# Altium schematic sheet transmitter_SCH.SchDoc
size A; SheetNumber: 1; SheetTotal: 1
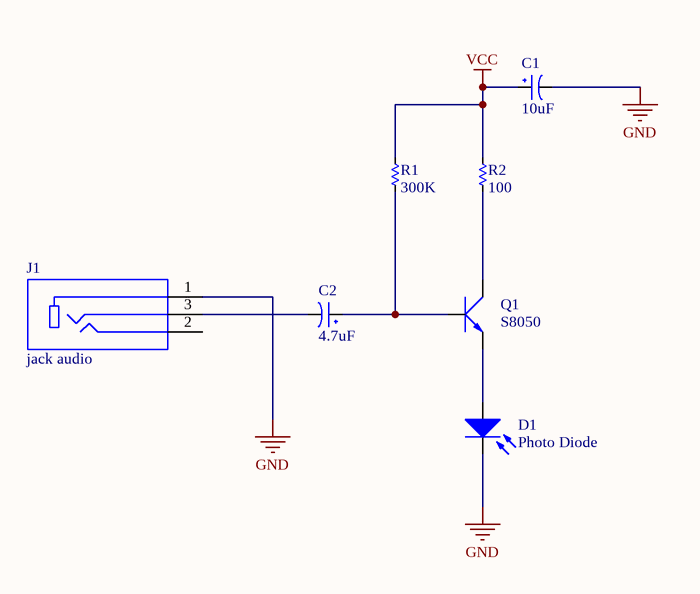
[diagram p0: transmitter_SCH.SchDoc]

## Parts
C1  10uF  [tu hoa 4mm]
C2  4.7uF  [tu hoa 5mm]
D1  Photo Diode  [LED-5 GRe]
J1  jack audio  [CUI_SJ1-3533N]
Q1  S8050  [TO92-123]
R1  300K  [RES-2W]
R2  100  [RES-2W]

## Nets
GND: C1.2 D1.2(K) J1.1
VCC: C1.1 R1.1 R2.1
NetC2_1: C2.1 Q1.2(B) R1.2
NetC2_2: C2.2 J1.3
NetD1_1: D1.1(A) Q1.1(E)
NetQ1_3: Q1.3(C) R2.2

Not connected (* = marked no-connect by the designer): J1 2

## Library data of the parts
C1 = Tu Hoa 10uF 16V 4x7: Cắm; So_Chan: 2; Don_Vi: Con; Ten_Linh_Kien: Tụ Hóa 10uF 16V; Ma_Hang: MH006855; Chung_Loai: Cắm; Kieu_Chan: *
C2 = Tu Hoa 4.7uF 50V 5x11: Cắm; Don_Vi: Con; So_Chan: 2; Ten_Linh_Kien: Tụ Hóa 4.7uF 50V 5x11MM; Ma_Hang: MH001357; Chung_Loai: Cắm; Kieu_Chan: *
D1 = Photo Diode: Photosensitive Diode
Q1 = 2N904: NPN 600mW, ECB; Value: C1815
R1 R2 = Res: Manufacturer: Generic Components; Class: Passive; SubClass: R; Published: 08/06/2000; Publisher: Altium Hobart Technology Centre